# EAGLE design Grill_simple_bord_onedirect (EAGLE 7.7.0)
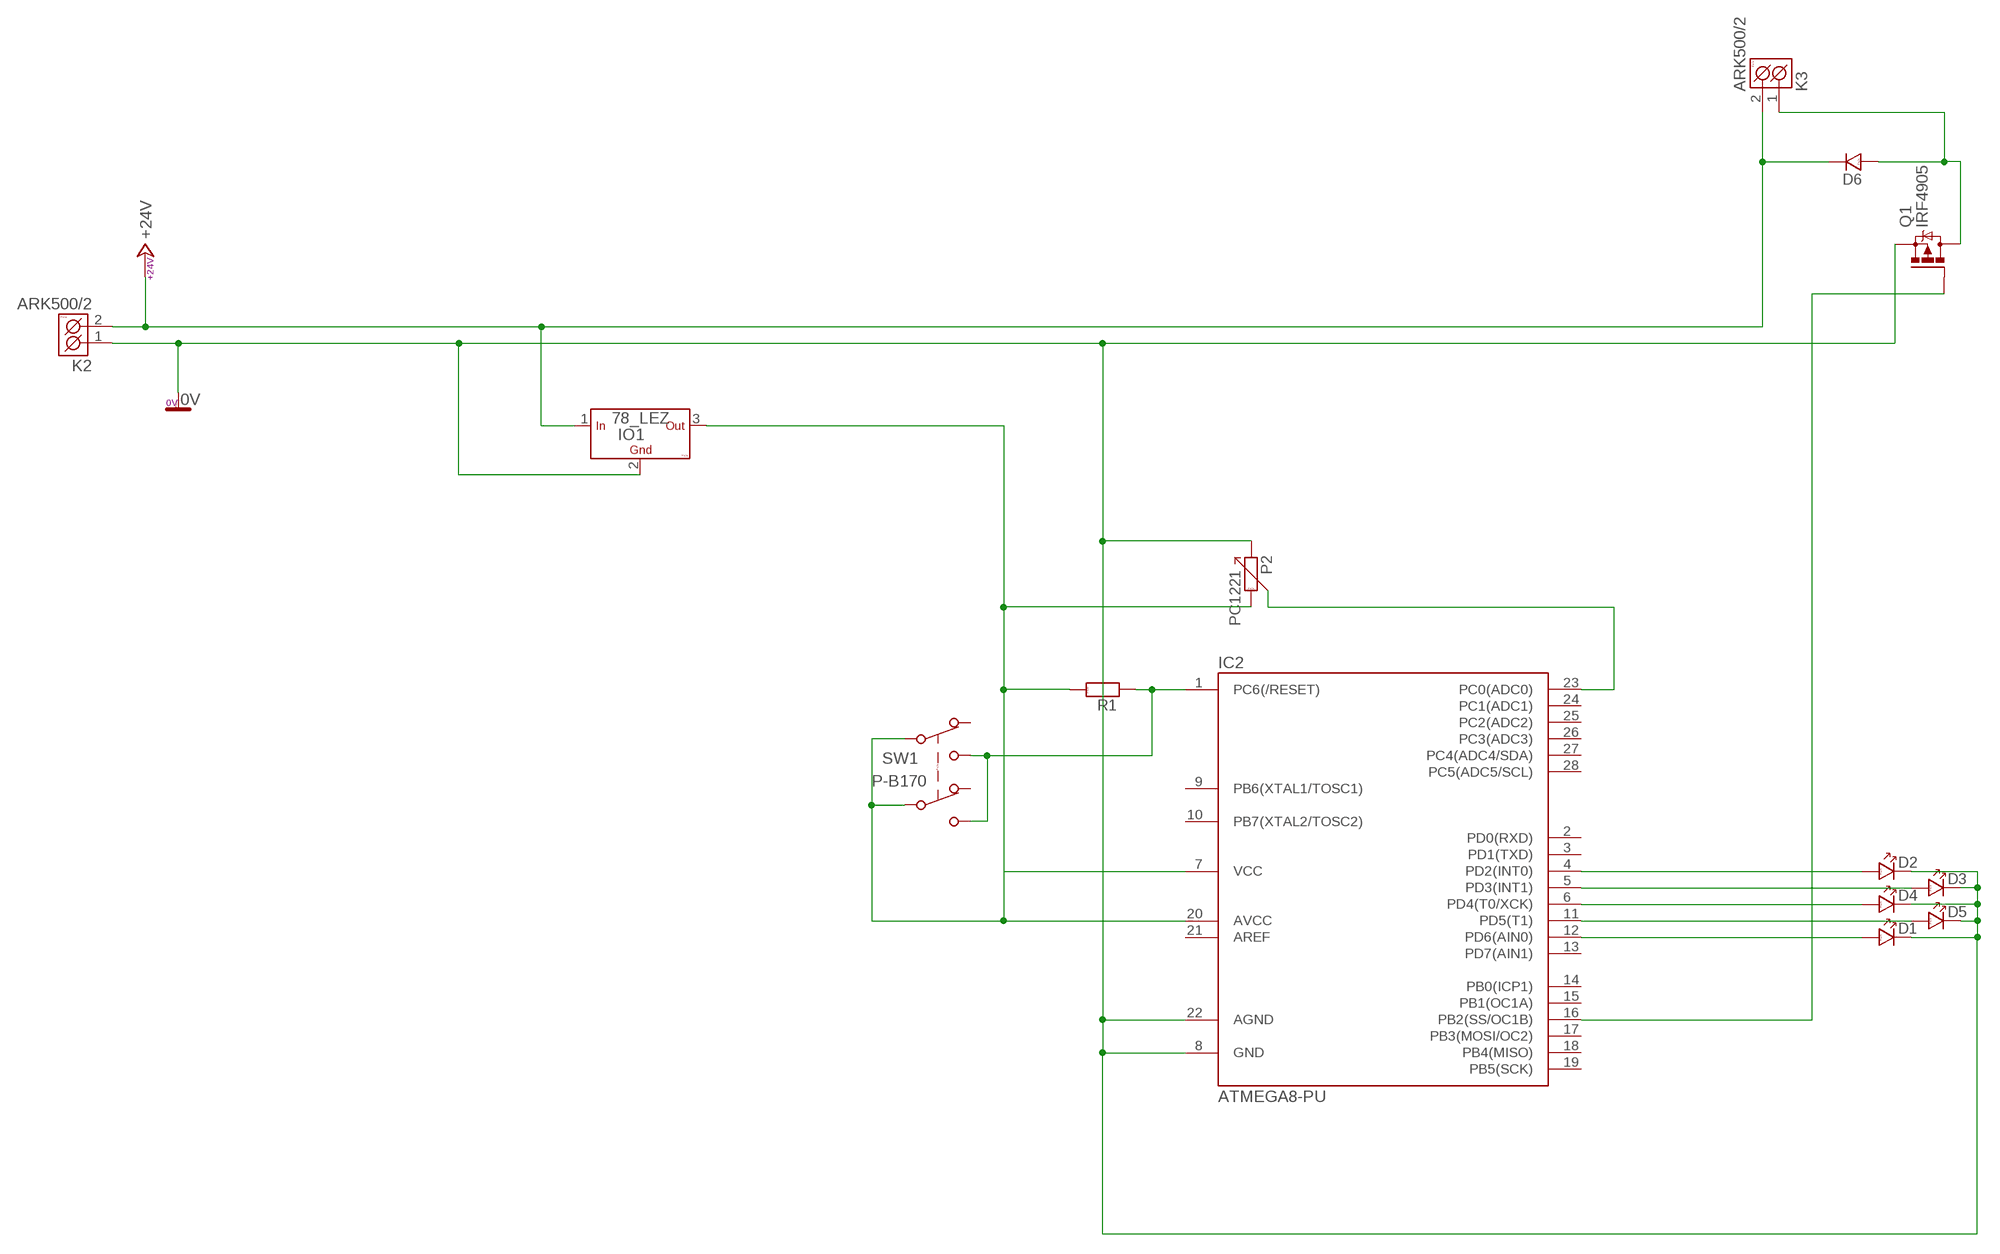
[diagram p0: schematic, sheet 1]

## Parts
D1  LED_5  [LED_5]
D2  LED_5  [LED_5]
D3  LED_5  [LED_5]
D4  LED_5  [LED_5]
D5  LED_5  [LED_5]
D6  D_10  [DO41]
IC2  ATMEGA8-PU  [DIL28-3]
IO1  78_LEZ  [TO-220]
K2  ARK500/2  [ARK500/2]
K3  ARK500/2  [ARK500/2]
P2  PC1221  [PC1221]
Q1  IRF4905  [TO220BH]
R1  R_7,5  [R-7,5]
SW1  P-B170  [P-B170]

## Nets
0V: D1.K D2.K D3.K D4.K D5.K IC2.8(GND) IC2.22(AGND) IO1.2(GND) K2.1(K1) P2.1 Q1.S
+24V: D6.K IO1.1(IN) K2.2(K2) K3.2(K2)
N$1: D5.A IC2.11(PD5(T1))
N$2: D6.A K3.1(K1) Q1.D
N$9: IC2.16(PB2(SS/OC1B)) Q1.G
N$12: IC2.23(PC0(ADC0)) P2.3
N$13: D2.A IC2.4(PD2(INT0))
N$14: D3.A IC2.5(PD3(INT1))
N$15: D4.A IC2.6(PD4(T0/XCK))
N$17: D1.A IC2.12(PD6(AIN0))
N$19: IC2.1(PC6(/RESET)) R1.1 SW1.2(R1) SW1.5(R2)
N$20: IC2.7(VCC) IC2.20(AVCC) IO1.3(OUT) P2.2 R1.2 SW1.3(X1) SW1.6(X2)
Unconnected: IC2.2(PD0(RXD)) IC2.3(PD1(TXD)) IC2.9(PB6(XTAL1/TOSC1)) IC2.10(PB7(XTAL2/TOSC2)) IC2.13(PD7(AIN1)) IC2.14(PB0(ICP1)) IC2.15(PB1(OC1A)) IC2.17(PB3(MOSI/OC2)) IC2.18(PB4(MISO)) IC2.19(PB5(SCK)) IC2.21(AREF) IC2.24(PC1(ADC1)) IC2.25(PC2(ADC2)) IC2.26(PC3(ADC3)) IC2.27(PC4(ADC4/SDA)) IC2.28(PC5(ADC5/SCL)) SW1.1(S1) SW1.4(S2)

## Library data of the parts
D1-D5 = #PaJa_31:LED: LED - jednobarevna
D6 = #PaJa_31:D: Dioda - univerzální
IC2 = atmega8:ATMEGA8-PU
IO1 = #PaJa_31:78?: Stabilizator - 1A a 1,5A ? - napeti => 05, 06, 08, 09, 12, 15, 18, 20, 24 => 1,5A ? - napeti => 10, 12, 15, 18 => 1A S ? - napeti => 05, 09, 10, 12, 15, 18, 24 => 2A T ? - napeti => 05 => 3A ------------------------------------------------------- Stabilizator - 100mA (TO-92 , SOT-89) ? - napeti => 02, 05, 06, 08, 09, 12, 15, 18
K2 K3 = #PaJa_konektory:ARK500/2: Svorkovnice - roztec 5mm - dvojita
P2 = #PaJa_31:PC1221: Potenciometr - kovovy - mono - 1k az 1M
Q1 = transistor-power:IRF4905: P-Channel HEXFET® Power MOSFET RDS(on)= 0.02 Ohm, ID = -74A Source: http://www.irf.com/product-info/datasheets/data/irf4905pbf.pdf
R1 = #PaJa_31:R: Rezistor
SW1 = #PaJa_prepinace:P-B170: Tlacitkovy prepinac - dvojity (8 x 8mm) P-B170G - s aretaci P-B170H - bez aretace

## Board
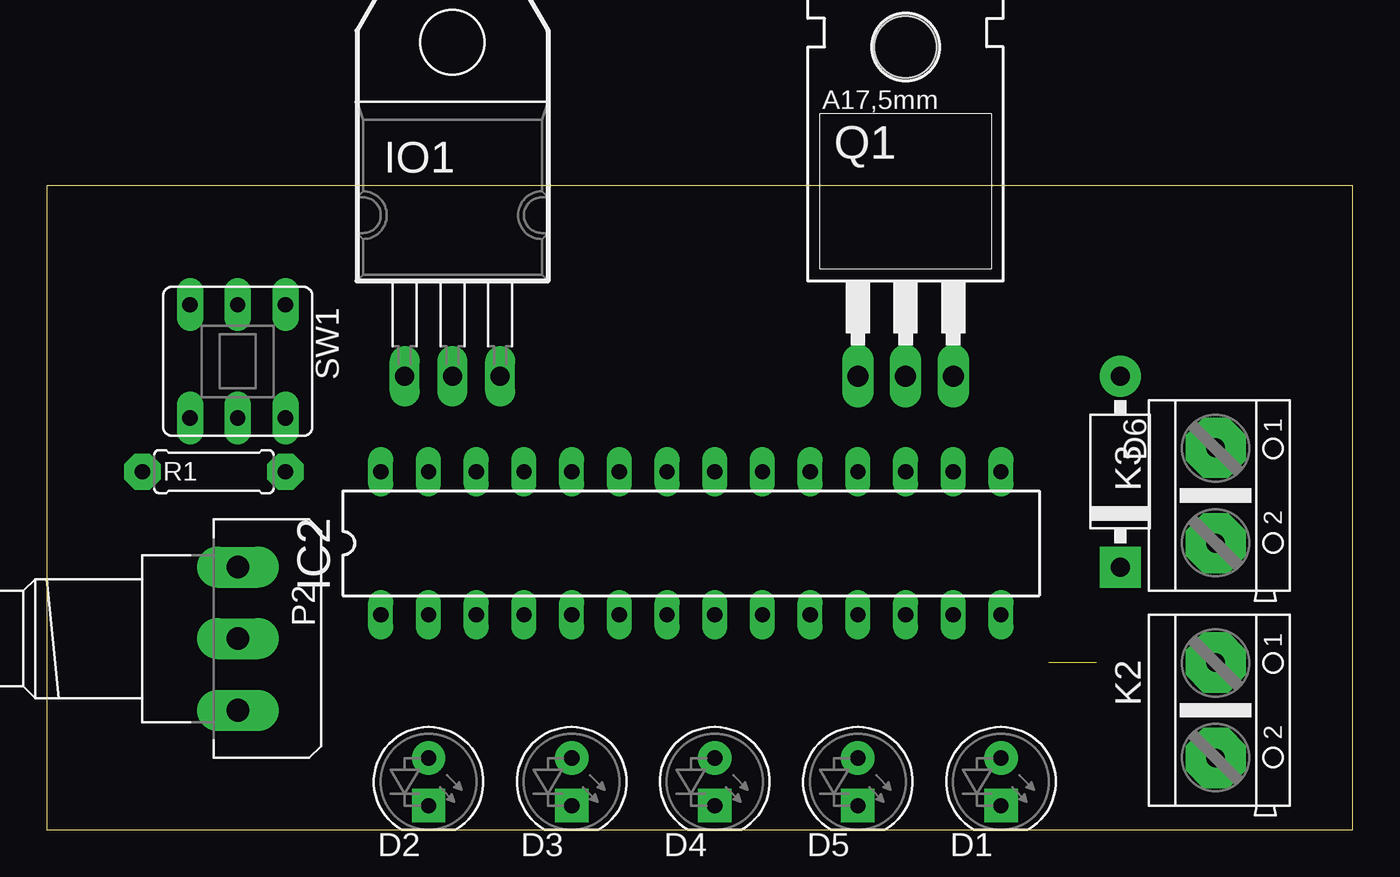
[diagram p1: board, top side]
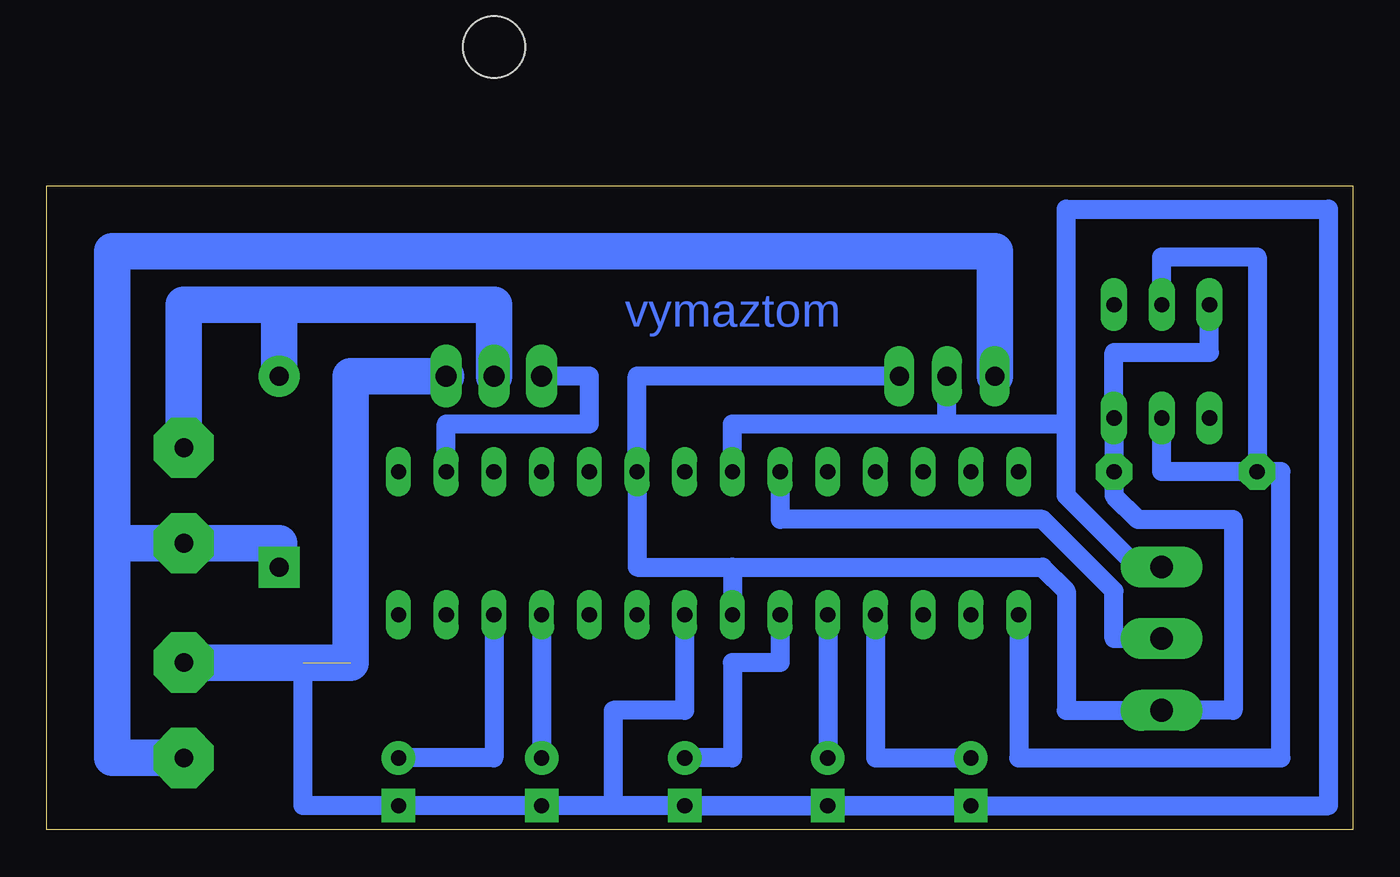
[diagram p2: board, bottom side, seen from below]

Size 69.52 x 34.28 mm. Coordinates in mm from the lower left corner, seen from the top.
Outline: 0,0 69.52,0 69.52,34.28 0,34.28 0,0
Copper layers (1*16): Top 0.035mm / dielectric 1.5mm / Bottom 0.035mm
Design rules "default": minimum track width 10mil, minimum drill 24mil, track to track 8mil, track to pad 8mil, pad to pad 8mil, via to via 8mil, smd to smd 8mil, copper to edge 40mil, drill to drill 8mil, minimum pad ring 10mil, minimum via ring 8mil, stop-mask expansion 4mil, vias tented up to drill 0mil, thermal gap 10mil

### Footprints (pad centres in the part's own frame; a part is rotated, then mirrored left to right if it is on the bottom)
LED_5 = drill 0.813 pad 1.778: A -1.27,0 | drill 0.813 pad 1.778 square: K 1.27,0
DO41 = drill 1.016 pad 2.184: A -5.08,0 | drill 1.016 pad 2.184 square: K 5.08,0
DIL28-3 = drill 0.813 long: 1 -16.51,-3.81; 2 -13.97,-3.81; 3 -11.43,-3.81; 4 -8.89,-3.81; 5 -6.35,-3.81; 6 -3.81,-3.81; 7 -1.27,-3.81; 8 1.27,-3.81; 9 3.81,-3.81; 10 6.35,-3.81; 11 8.89,-3.81; 12 11.43,-3.81; 13 13.97,-3.81; 14 16.51,-3.81; 15 16.51,3.81; 16 13.97,3.81; 17 11.43,3.81; 18 8.89,3.81; 19 6.35,3.81; 20 3.81,3.81; 21 1.27,3.81; 22 -1.27,3.81; 23 -3.81,3.81; 24 -6.35,3.81; 25 -8.89,3.81; 26 -11.43,3.81; 27 -13.97,3.81; 28 -16.51,3.81
TO-220 = drill 1.016 pad 1.6 long: 1 -2.54,0; 2 0,0; 3 2.54,0
ARK500/2 = drill 1 pad 3.2 octagon: 1 -2.54,0; 2 2.54,0
PC1221 = drill 1.2 pad 2.184 long: 1 -3.81,0; 2 3.81,0; 3 0,0
TO220BH = drill 1.118 long: D 0,-6.35; G -2.54,-6.35; S 2.54,-6.35 | hole 3.302: 0,11.176
R-7,5 = drill 0.813 pad 1.93 octagon: 1 -3.81,0; 2 3.81,0
P-B170 = drill 0.813 pad 1.4 long: 1 0,5.08; 2 0,2.54; 3 0,0; 4 6.032,0; 5 6.032,2.54; 6 6.032,5.08

### Placement (x,y rotation side)
D1  50.8,2.54 270 top
D2  20.32,2.54 270 top
D3  27.94,2.54 270 top
D4  35.56,2.54 270 top
D5  43.18,2.54 270 top
D6  57.15,19.05 270 top
IC2  34.29,15.24 0 top
IO1  21.59,24.13 0 top
K2  62.23,6.35 270 top
K3  62.23,17.78 270 top
P2  10.16,10.16 270 top
Q1  45.72,30.48 0 top
R1  8.89,19.05 0 top
SW1  7.62,27.94 270 top

### Tracks (layer width: path | path; a pad name or v marks a point on that pad's centre or on a via)
0V  (1 unrouted)
  Bottom 1.016: D2.K D3.K D4.K | D4.K 39.37,1.27 | 39.37,1.27 D5.K D1.K 55.88,1.27 55.88,8.89 | 21.59,21.59 33.02,21.59 IC2.22 | 21.59,21.59 IO1.2 | 21.59,21.59 15.24,21.59 | 15.24,21.59 15.24,33.02 1.27,33.02 1.27,1.27 D4.K | IC2.8 35.56,6.35 39.37,6.35 39.37,1.27 | P2.1 11.43,13.97 15.24,17.78 15.24,21.59
  Bottom 1.93: K2.1 53.34,8.89 53.34,24.13 Q1.S
+24V
  Bottom 1.93: IO1.1 19.05,30.77 66.04,30.77 66.04,15.24 | K2.2 66.04,3.81 66.04,15.24 | 66.04,15.24 K3.2 57.15,15.24 D6.K
N$1
  Bottom 1.016: IC2.11 D5.A
N$2
  Bottom 1.93: Q1.D 45.72,27.94 57.15,27.94 | 57.15,27.94 62.23,27.94 K3.1 | D6.A 57.15,27.94
N$9
  Bottom 1.016: IC2.16 48.26,21.59 40.64,21.59 40.64,24.13 Q1.G
N$12
  Bottom 1.016: IC2.23 30.48,16.51 16.51,16.51 12.7,12.7 12.7,10.16 P2.3
N$13
  Bottom 1.016: IC2.4 25.4,3.81 D2.A
N$14
  Bottom 1.016: IC2.5 D3.A
N$15
  Bottom 1.016: IC2.6 30.48,8.89 33.02,8.89 33.02,3.81 D4.A
N$17
  Bottom 1.016: IC2.12 45.72,3.81 D1.A
N$19
  Bottom 1.016: SW1.2 10.16,30.48 5.08,30.48 R1.1 | SW1.5 10.16,19.05 R1.1 | IC2.1 17.78,3.81 3.81,3.81 3.81,19.05 R1.1
N$20
  Bottom 1.016: IO1.3 38.1,24.13 IC2.20 38.1,13.97 33.02,13.97 | SW1.3 7.62,25.4 12.7,25.4 SW1.6 R1.2 12.7,17.78 11.43,16.51 6.35,16.51 6.35,6.35 P2.2 15.24,6.35 15.24,12.7 16.51,13.97 33.02,13.97 | 33.02,13.97 IC2.7

### Text on the board
Bottom: vymaztom